# Altium project Howland_Current_1.PrjPcb
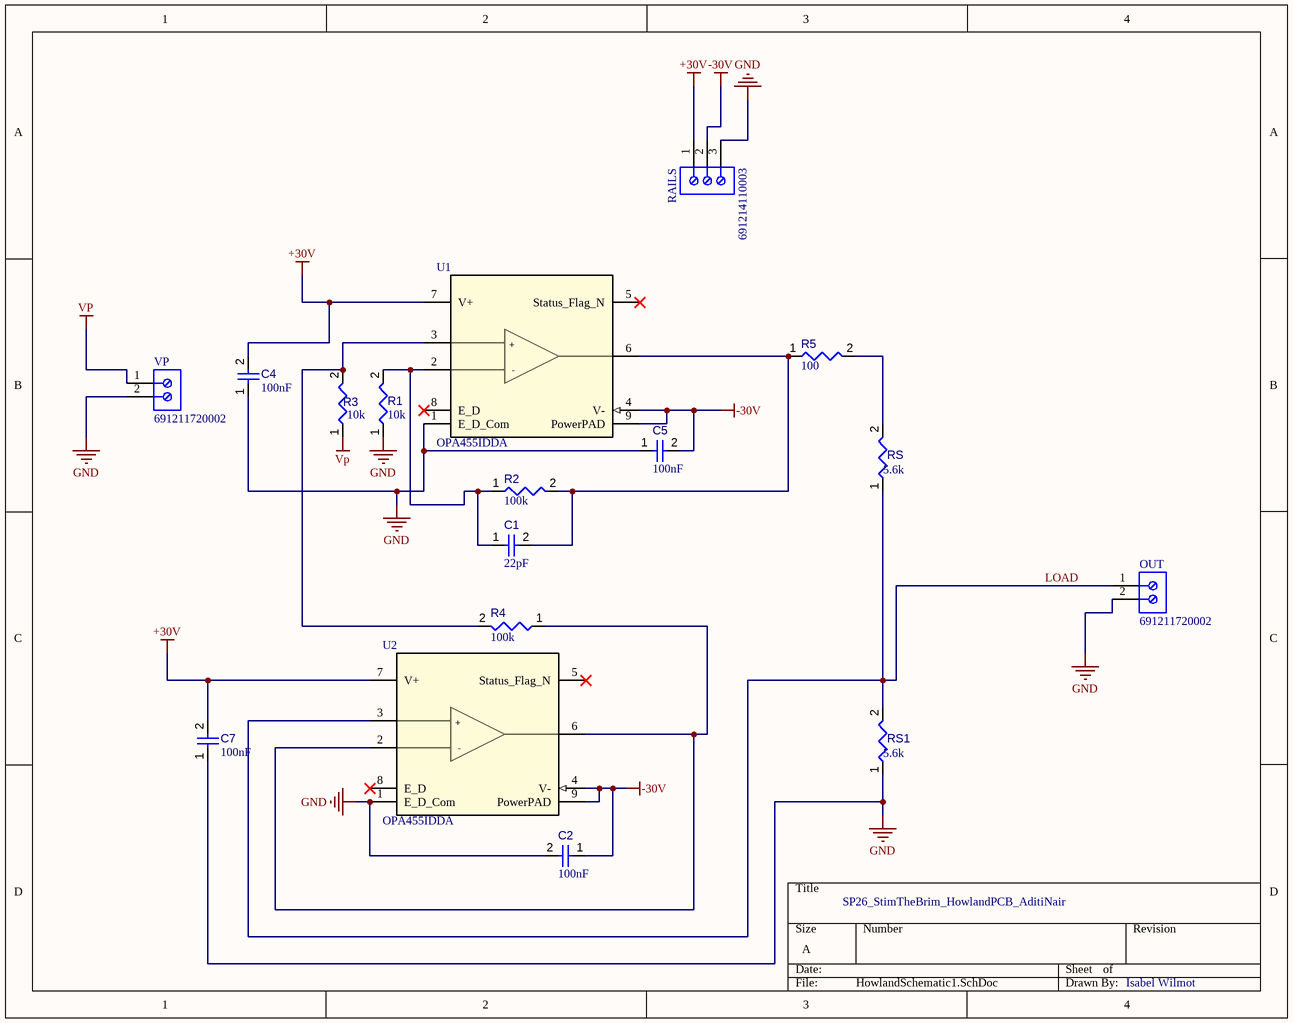
[diagram p0: HowlandSchematic1.SchDoc]
1 sheet, 17 parts. Net scope: global (net labels, ports and power ports of the same name join across sheets).
Board file: PCB1.PcbDoc

## Sheet HowlandSchematic1.SchDoc
size A; SheetNumber: 1; SheetTotal: 1

### Parts
C1  value 22pF  [Copy of CAPC0402(1005)60_L]  (hidden comment: Capacitor 22pF +/-10% 50V 0402)
C2  value 100nF  [CAPC0402(1005)60_L]  (hidden comment: Capacitor 100nF +/-20% 25V 0402)
C4  value 100nF  [CAPC0402(1005)60_L]  (hidden comment: Capacitor 100nF +/-20% 10V 0402)
C5  value 100nF  [CAPC0402(1005)60_L]  (hidden comment: Capacitor 100nF +/-20% 25V 0402)
C7  value 100nF  [CAPC0402(1005)60_L]  (hidden comment: Capacitor 100nF +/-20% 10V 0402)
OUT  691211720002  [691211720002]
R1  value 10k  [RESC0402(1005)_L]  (hidden comment: Resistor 10K  +/-1 % 0402 63 mW)
R2  value 100k  [RESC1005X40X25ML05T05]  (hidden comment: Resistor 100k +/-1% 0402 63 mW)
R3  value 10k  [RESC0402(1005)_L]  (hidden comment: Resistor 10K  +/-1 % 0402 63 mW)
R4  value 100k  [RESC1005X40X25ML05T05]  (hidden comment: Resistor 100k +/-1% 0402 63 mW)
R5  value 100  [RESC0402(1005)_L]  (hidden comment: Resistor 100R +/-1 % 0402 63 mW)
RAILS  691214110003  [691214110003]
RS  value 5.6k  [RESC0402(1005)_L]  (hidden comment: Resistor 5K6  +/-5 % 0402 63 mW)
RS1  value 5.6k  [RESC0402(1005)_L]  (hidden comment: Resistor 5K6  +/-5 % 0402 63 mW)
U1  OPA455IDDA  [DDA0008J-IPC_A]
U2  OPA455IDDA  [DDA0008J-IPC_A]
VP  691211720002  [691211720002]

### Nets
+30V: C4.2 C7.2 RAILS.1 U1.7(V+) U2.7(V+)
-30V: C2.1 C5.2 RAILS.2 U1.4(V-) U1.9(PowerPAD) U2.4(V-) U2.9(PowerPAD)
GND: C2.2 C4.1 C5.1 C7.1 OUT.2 R1.1 RAILS.3 RS1.1 U1.1(E_D_Com) U2.1(E_D_Com) VP.2
Vp: R3.1 VP.1
LOAD: OUT.1 RS.1 RS1.2 U2.3(+IN)
NetC1_1: C1.1 R1.2 R2.1 U1.2(-IN)
NetC1_2: C1.2 R2.2 R5.1 U1.6(OUT)
NetR3_2: R3.2 R4.2 U1.3(+IN)
NetR4_1: R4.1 U2.2(-IN) U2.6(OUT)
NetR5_2: R5.2 RS.2

Not connected (* = marked no-connect by the designer): U1 5(Status_Flag_N)* 8(E_D)*; U2 5(Status_Flag_N)* 8(E_D)*

### Notes on the sheet
- SP26_StimTheBrim_HowlandPCB_AditiNair
- Isabel Wilmot
- (in symbol OPA455IDDA) +; -

### Library data of the parts
C1 = CMP-001-00073-4: Chip Capacitor, 22pF +/-10%, 50V, 0402, Thickness 0.6 mm; Tolerance: 10%; Pins: 2; Voltage Rating: 50V; Max Operating Temperature: 85°C; Min Operating Temperature: -55°C; Mounting Technology: SMT; Case/Package: 0402
C2 C5 = CMP-001-00065-4: Chip Capacitor, 100nF +/-20%, 25V, 0402, Thickness 0.6 mm; Tolerance: 10%; Max Operating Temperature: 85°C; Min Operating Temperature: -55°C; Case/Package: 0402; Mounting Technology: SMT; Pins: 2; Voltage Rating: 25V
C4 C7 = CMP-001-00061-3: Chip Capacitor, 100nF +/-20%, 10V, 0402, Thickness 0.6 mm; Tolerance: 20%; Max Operating Temperature: 85°C; Min Operating Temperature: -55°C; Case/Package: 0402; Mounting Technology: SMT; Pins: 2; Voltage Rating: 10V
OUT VP = CMP-1502-02524-3: 211 Series 5MM Pitch Straight, Pcb Terminal Block, Through Hole, 2 Way; Number of Levels: 1; Current: 10A; Voltage: 300V; Pitch: 5.0038mm; Wire Gauge (Min): 12AWG; Connector Type: PCB, Terminal Block; Number of Positions Per Level: 2; Plating: Brass, Steel; Wire Gauge (Max): 24AWG; Stripping Length: -7mm; Termination: Screw; Height: 15.5mm; Contact Plating: Tin; REACH SVHC: Unknown; Contact Material: Brass; Width: 10mm; RoHS: Compliant; Number of Pins: 2; Lead Pitch: 5mm; Mount: Through Hole; Min Operating Temperature: -40°C; Length: 13.7mm; Number of Contacts: 2; Color: Green; Wire/Cable Gauge: 12AWG; Housing Material: Nylon; Packaging: Box; Max Operating Temperature: 105°C
R1 R3 = CMP-009-00149-3: Chip Resistor, 10 kOhms, +/-1 %, 63 mW, -55 to 125 degC, 0402; Power: 63mW; Tolerance: 1%; Min Operating Temperature: -55°C; Case/Package: 0402; Max Operating Temperature: 155°C; Pins: 2
R2 R4 = CMP-009-00021-5: Chip Resistor, 100 KOhm, +/- 1%, 0.063 W, -55 to 155 degC, 0402 (1005 Metric); Power: 63mW; Voltage Rating: 50V; RoHS Compliant: True; Case/Package: 0402; Max Operating Temperature: 155°C; Mounting Technology: SM; Pins: 2; Min Operating Temperature: -55°C; Tolerance: 1%
R5 = CMP-009-00167-3: Chip Resistor, 100 Ohms, +/-1 %, 63 mW, -55 to 155 degC, 0402; Power: 63mW; Tolerance: 1%; Min Operating Temperature: -55°C; Case/Package: 0402; Pins: 2; Max Operating Temperature: 155°C
RAILS = CMP-1502-02466-3: 2141 Series 3.5MM Pitch Straight, Pcb Terminal Block, Through Hole, 3 Way; Wire Gauge (Max): 24AWG; Current Rating: 10A; Wire Gauge (Min): 16AWG; Plating: Brass, Steel; Number of Levels: 1; Voltage Rating: 300V; Number of Contacts: 3; Pitch: 3.5052mm; Stripping Length: -6mm; Min Operating Temperature: -40°C; Height: 12.2mm; Length: 7.4mm; Termination: Screw; Contact Plating: Brass, Tin; Housing Material: Nylon; Packaging: Box; Contact Material: Brass; Max Operating Temperature: 105°C; Number of Pins: 3; Wire/Cable Gauge: 24AWG; Lead Pitch: 3.5mm; Width: 10.9mm; Color: Blue, Green; Number of Positions Per Level: 3; Mount: Through Hole; RoHS: Compliant; Voltage: 300V; Current: 10A
RS RS1 = CMP-009-00136-3: Chip Resistor, 5,6 kOhms, +/-5 %, 63 mW, -55 to 155 degC, 0402; Tolerance: 5%; Power: 63mW; Case/Package: 0402; Max Operating Temperature: 155°C; Min Operating Temperature: -55°C; Pins: 2
U1 U2 = OPA455IDDA: 150-V, wide bandwidth 6.5-MHz, high-slew rate 32-V/Âµs unity-gain stable op amp 8-SO PowerPAD -40 to 85; Manufacturer_Name: Texas Instruments; TYPE: TYPE; RefDes: RefDes; Copyright: Copyright (C) 2026 Ultra Librarian. All rights reserved.; Manufacturer_Part_Number: OPA455IDDA; Datasheet: https://www.ti.com/lit/gpn/opa455